# EAGLE board DF32-revision-A (EAGLE 6.6.0), part 1 of 2
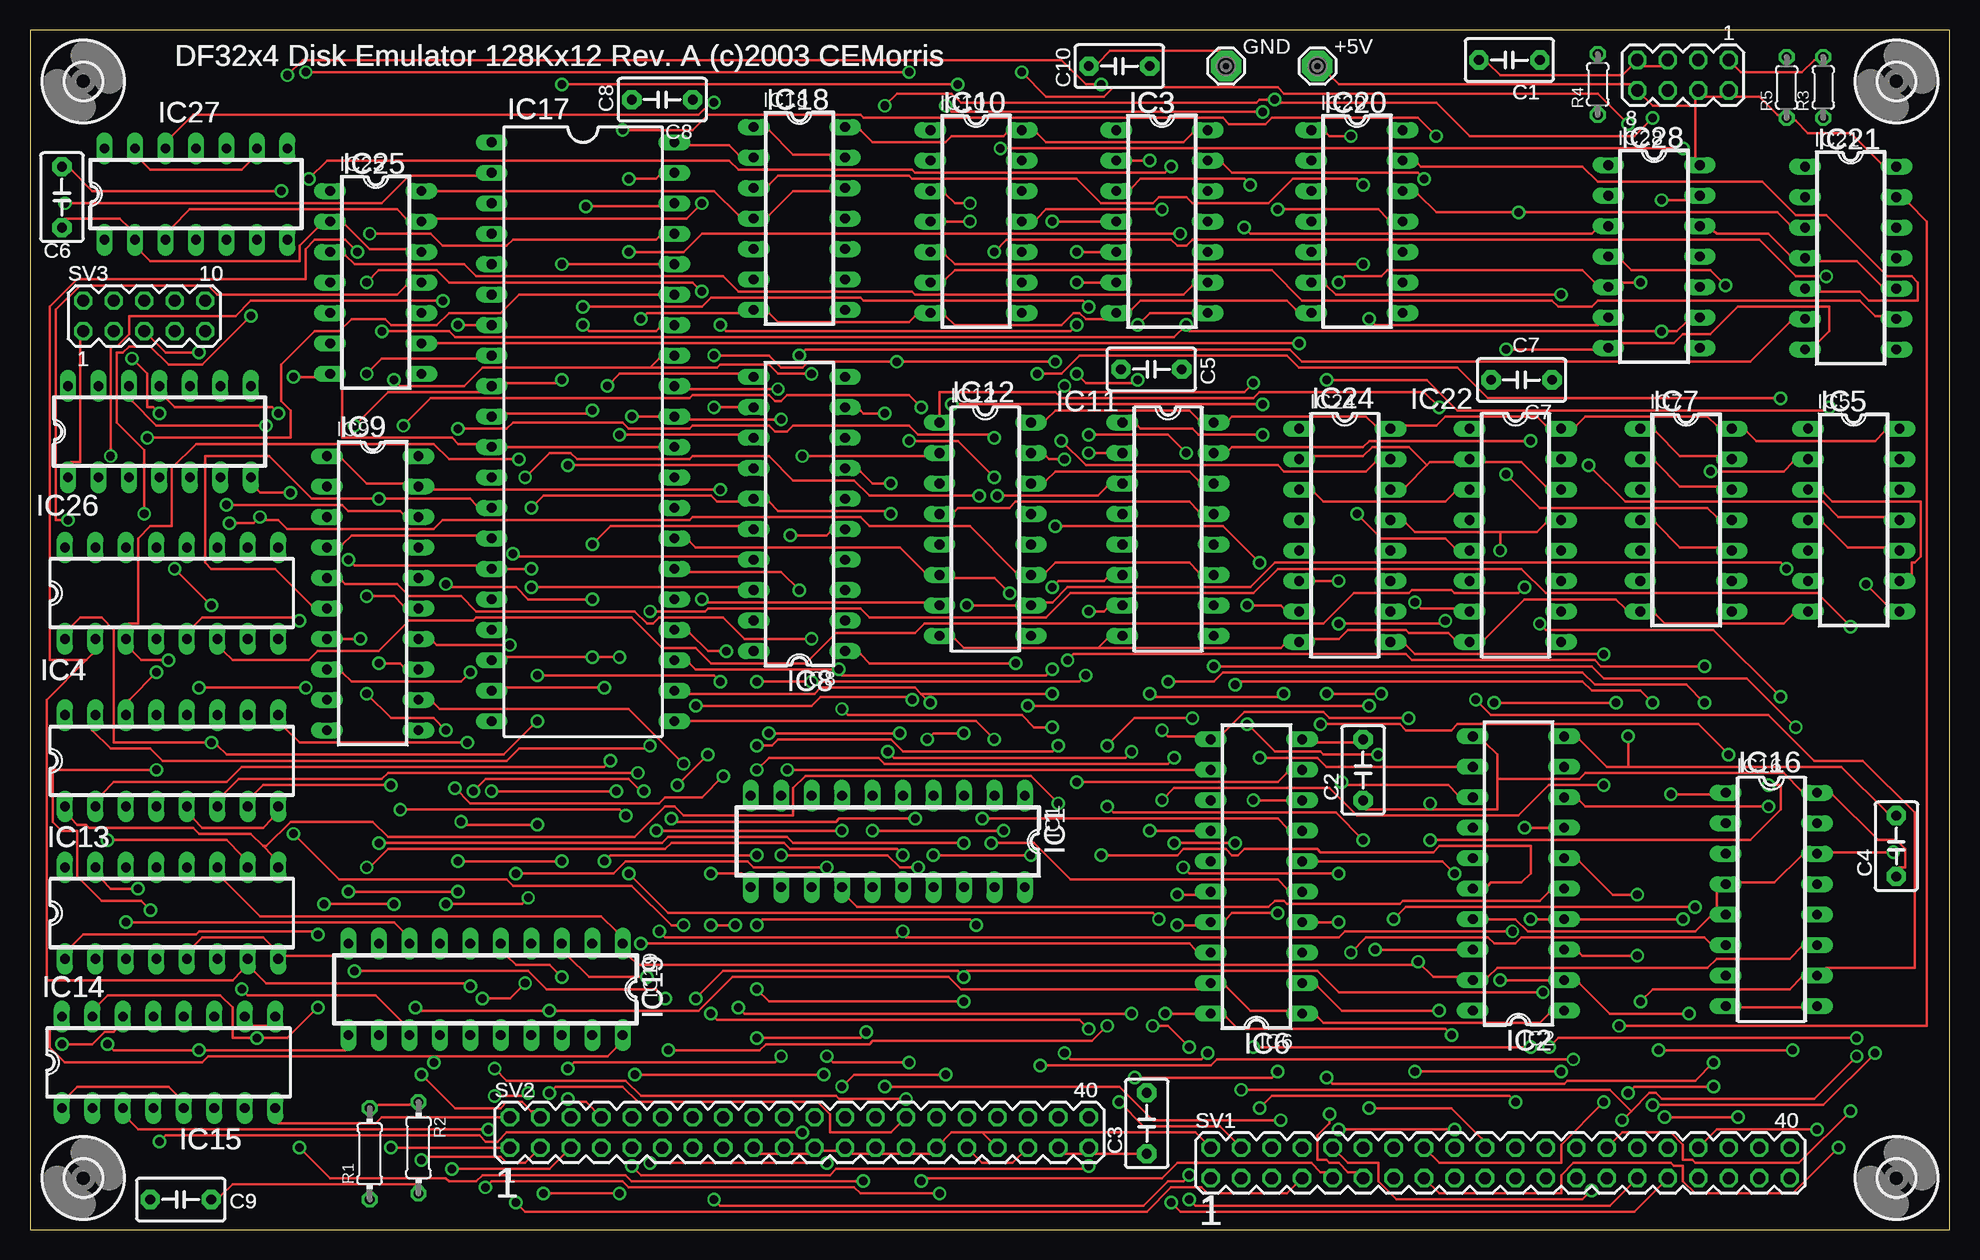
[diagram p2: board, top side]
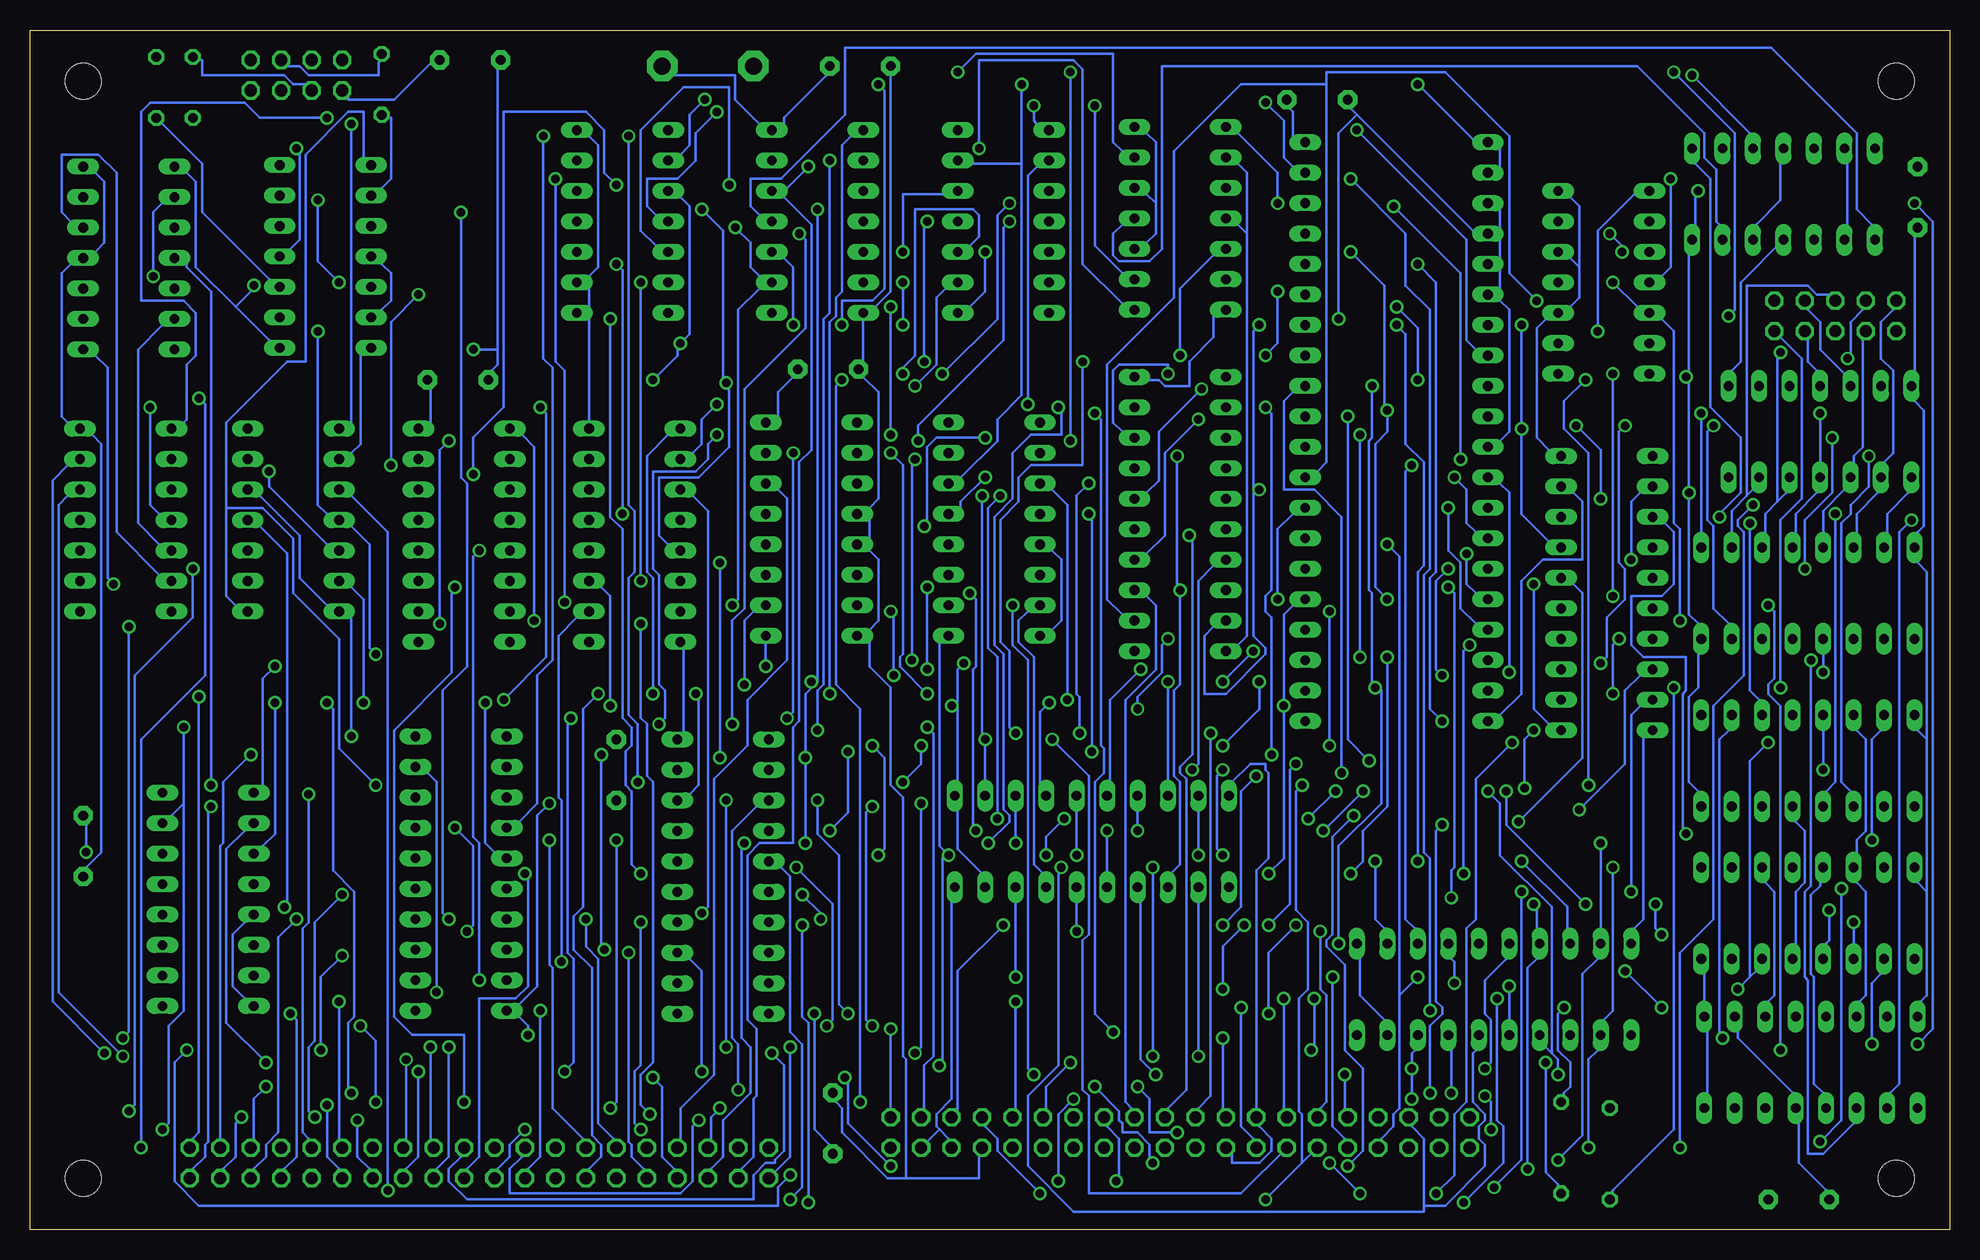
[diagram p3: board, bottom side, seen from below]

Size 160 x 100 mm. Coordinates in mm from the lower left corner, seen from the top.
Outline: 0,0 160,0 160,100 0,100 0,0
Copper layers (1*16): Top 0.035mm / dielectric 1.5mm / Bottom 0.035mm
Design rules "default": minimum track width 8mil, minimum drill 28mil, track to track 8mil, track to pad 8mil, pad to pad 8mil, via to via 8mil, smd to smd 8mil, copper to edge 40mil, drill to drill 8mil, minimum pad ring 10mil, minimum via ring 8mil, stop-mask expansion 4mil, vias tented up to drill 0mil, thermal gap 10mil

## Footprints (pad centres in the part's own frame; a part is rotated, then mirrored left to right if it is on the bottom)
SE14 = drill 1.397 pad 2.54 octagon: MP 0,0
C5B3.5 = drill 0.813 pad 1.6 octagon: 1 -2.54,0; 2 2.54,0
DIL20 = drill 0.813 long: 1 -11.43,-3.81; 2 -8.89,-3.81; 3 -6.35,-3.81; 4 -3.81,-3.81; 5 -1.27,-3.81; 6 1.27,-3.81; 7 3.81,-3.81; 8 6.35,-3.81; 9 8.89,-3.81; 10 11.43,-3.81; 11 11.43,3.81; 12 8.89,3.81; 13 6.35,3.81; 14 3.81,3.81; 15 1.27,3.81; 16 -1.27,3.81; 17 -3.81,3.81; 18 -6.35,3.81; 19 -8.89,3.81; 20 -11.43,3.81
DIL14 = drill 0.813 long: 1 -7.62,-3.81; 2 -5.08,-3.81; 3 -2.54,-3.81; 4 0,-3.81; 5 2.54,-3.81; 6 5.08,-3.81; 7 7.62,-3.81; 8 7.62,3.81; 9 5.08,3.81; 10 2.54,3.81; 11 0,3.81; 12 -2.54,3.81; 13 -5.08,3.81; 14 -7.62,3.81
DIL16 = drill 0.813 long: 1 -8.89,-3.81; 2 -6.35,-3.81; 3 -3.81,-3.81; 4 -1.27,-3.81; 5 1.27,-3.81; 6 3.81,-3.81; 7 6.35,-3.81; 8 8.89,-3.81; 9 8.89,3.81; 10 6.35,3.81; 11 3.81,3.81; 12 1.27,3.81; 13 -1.27,3.81; 14 -3.81,3.81; 15 -6.35,3.81; 16 -8.89,3.81
DIL40 = drill 0.813 long: 1 -24.13,-7.62; 2 -21.59,-7.62; 3 -19.05,-7.62; 4 -16.51,-7.62; 5 -13.97,-7.62; 6 -11.43,-7.62; 7 -8.89,-7.62; 8 -6.35,-7.62; 9 -3.81,-7.62; 10 -1.27,-7.62; 11 1.27,-7.62; 12 3.81,-7.62; 13 6.35,-7.62; 14 8.89,-7.62; 15 11.43,-7.62; 16 13.97,-7.62; 17 16.51,-7.62; 18 19.05,-7.62; 19 21.59,-7.62; 20 24.13,-7.62; 21 24.13,7.62; 22 21.59,7.62; 23 19.05,7.62; 24 16.51,7.62; 25 13.97,7.62; 26 11.43,7.62; 27 8.89,7.62; 28 6.35,7.62; 29 3.81,7.62; 30 1.27,7.62; 31 -1.27,7.62; 32 -3.81,7.62; 33 -6.35,7.62; 34 -8.89,7.62; 35 -11.43,7.62; 36 -13.97,7.62; 37 -16.51,7.62; 38 -19.05,7.62; 39 -21.59,7.62; 40 -24.13,7.62
0204/7 = drill 0.813 octagon: 1 -3.81,0; 2 3.81,0
0204/5 = drill 0.813 octagon: 1 -2.54,0; 2 2.54,0
MA20-2 = drill 1.016 octagon: 1 -24.13,-1.27; 2 -24.13,1.27; 3 -21.59,-1.27; 4 -21.59,1.27; 5 -19.05,-1.27; 6 -19.05,1.27; 7 -16.51,-1.27; 8 -16.51,1.27; 9 -13.97,-1.27; 10 -13.97,1.27; 11 -11.43,-1.27; 12 -11.43,1.27; 13 -8.89,-1.27; 14 -8.89,1.27; 15 -6.35,-1.27; 16 -6.35,1.27; 17 -3.81,-1.27; 18 -3.81,1.27; 19 -1.27,-1.27; 20 -1.27,1.27; 21 1.27,-1.27; 22 1.27,1.27; 23 3.81,-1.27; 24 3.81,1.27; 25 6.35,-1.27; 26 6.35,1.27; 27 8.89,-1.27; 28 8.89,1.27; 29 11.43,-1.27; 30 11.43,1.27; 31 13.97,-1.27; 32 13.97,1.27; 33 16.51,-1.27; 34 16.51,1.27; 35 19.05,-1.27; 36 19.05,1.27; 37 21.59,-1.27; 38 21.59,1.27; 39 24.13,-1.27; 40 24.13,1.27
MA05-2 = drill 1.016 octagon: 1 -5.08,-1.27; 2 -5.08,1.27; 3 -2.54,-1.27; 4 -2.54,1.27; 5 0,-1.27; 6 0,1.27; 7 2.54,-1.27; 8 2.54,1.27; 9 5.08,-1.27; 10 5.08,1.27
MA04-2 = drill 1.016 octagon: 1 -3.81,-1.27; 2 -3.81,1.27; 3 -1.27,-1.27; 4 -1.27,1.27; 5 1.27,-1.27; 6 1.27,1.27; 7 3.81,-1.27; 8 3.81,1.27
3,0 = hole 3: 0,0

## Placement (x,y rotation side)
+5V  SE14  [SE14]  107.31,96.99 0 top
C1  [C5B3.5]  123.31,97.5 180 top
C2  [C5B3.5]  111.12,38.32 90 top
C3  [C5B3.5]  93.09,8.85 90 top
C4  [C5B3.5]  155.57,31.97 90 top
C5  [C5B3.5]  93.47,71.72 180 top
C6  [C5B3.5]  2.66,86.07 90 top
C7  [C5B3.5]  124.33,70.83 180 top
C8  [C5B3.5]  52.7,94.2 180 top
C9  [C5B3.5]  12.57,2.5 180 top
C10  [C5B3.5]  90.8,96.99 180 top
GND  SE14  [SE14]  99.69,96.99 0 top
IC1  74LS240N  [DIL20]  71.5,32.35 180 top
IC2  74LS244N  [DIL20]  124.07,29.68 90 top
IC3  74LS00N  [DIL14]  94.36,84.04 270 top
IC4  74LS138N  [DIL16]  11.81,53.05 0 top
IC5  74LS32N  [DIL14]  152.01,59.14 270 top
IC6  74LS244N  [DIL20]  102.23,29.43 90 top
IC7  74LS74N  [DIL14]  138.04,59.14 270 top
IC8  74LS240N  [DIL20]  64.13,59.65 90 top
IC9  74LS240N  [DIL20]  28.57,53.05 270 top
IC10  74LS04N  [DIL14]  78.86,84.04 270 top
IC11  74LS191N  [DIL16]  94.86,58.38 270 top
IC12  74LS191N  [DIL16]  79.62,58.38 270 top
IC13  74LS191N  [DIL16]  11.81,39.08 0 top
IC14  74LS191N  [DIL16]  11.81,26.38 0 top
IC15  74LS191N  [DIL16]  11.55,13.93 0 top
IC16  74LS191N  [DIL16]  145.16,27.52 270 top
IC17  DS1258  [DIL40]  46.1,66.51 270 top
IC18  74LS74N  [DIL14]  64.13,84.29 270 top
IC19  74LS240N  [DIL20]  37.97,20.03 180 top
IC20  74LS02N  [DIL14]  110.61,84.04 270 top
IC21  74LS01N  [DIL14]  151.76,80.99 270 top
IC22  74LS155N  [DIL16]  123.82,57.87 270 top
IC24  74LS155N  [DIL16]  109.6,57.87 270 top
IC25  74LS74N  [DIL14]  28.82,78.96 270 top
IC26  74LS30N  [DIL14]  10.79,66.51 0 top
IC27  74LS86N  [DIL14]  13.84,86.32 0 top
IC28  74LS07N  [DIL14]  135.38,81.11 270 top
R1  470  [0204/7]  28.32,6.31 90 top
R2  10K  [0204/7]  32.38,6.82 270 top
R3  220  [0204/5]  149.47,95.21 90 top
R4  220  [0204/5]  130.68,95.47 90 top
R5  220  [0204/5]  146.43,95.21 270 top
SV1  BUS1  [MA20-2]  122.55,5.55 0 top
SV2  BUS2  [MA20-2]  64.13,8.09 0 top
SV3  WRLOCK  [MA05-2]  9.52,76.16 0 top
SV4  PANEL LEDS  [MA04-2]  137.79,96.23 180 top
U$1  [3,0]  4.44,95.72 0 top
U$2  [3,0]  4.44,4.28 0 top
U$3  [3,0]  155.57,4.28 0 top
U$4  [3,0]  155.57,95.72 0 top

## Tracks (layer width: path | path; a pad name or v marks a point on that pad's centre or on a via)
660-663  (via drill 0.71)
  Top 0.203: v76.32,93.69 76.83,93.18 v102.74,93.18
  Bottom 0.203: v76.32,93.69 76.32,92.42 76.07,92.16 IC10.1 | v102.74,93.18 104.52,91.4 104.52,89.12 106.04,87.59 108.58,87.59 108.58,85.31 107.82,84.54 IC20.4
!660-663  (via drill 0.71)
  Top 0.203: 116.45,63.72 116.71,63.97 118.74,63.97 IC22.2 121.28,63.97 124.33,63.97 126.36,61.94 IC22.14 | 116.45,63.72 114.68,61.94 IC24.14 | v76.83,68.8 v102.74,68.8 | 116.45,63.72 114.93,65.24 111.88,65.24 111.12,64.48 107.06,64.48 IC24.2
  Bottom 0.203: v76.83,68.8 76.83,87.85 76.07,88.61 IC10.2 | v102.74,68.8 104.01,67.53 104.01,65.49 104.77,64.73 IC24.2
!(NED+EWL)  (via drill 0.71)
  Top 0.203: v110.1,91.15 108.33,91.15 108.07,91.4 IC20.1 | v109.34,37.3 109.6,37.05 118.23,37.05 118.99,36.28 IC2.13
  Bottom 0.203: v110.1,91.15 110.1,60.41 109.6,59.91 109.6,54.83 110.1,54.32 110.1,42.89 109.34,42.13 v109.34,37.3
!ACBUS0  (via drill 0.71)
  Top 0.203: v133.98,22.82 129.41,22.82 129.15,23.08 IC2.3 | v146.93,14.95 v135.76,14.95 | v96.64,4.53 96.13,4.03 94.86,4.03 92.83,1.99 57.53,1.99 v57.02,2.5 | v53.97,37.05 v56.51,39.59 | v57.02,68.54 IC8.12
  Bottom 0.203: v133.98,22.82 135.76,21.04 v135.76,14.95 | v146.93,14.95 147.95,13.93 147.95,4.03 145.92,1.99 97.66,1.99 97.66,3.52 v96.64,4.53 | 53.97,5.55 v57.02,2.5 | SV2.11 53.97,5.55 | v57.02,68.54 56.51,68.03 56.51,53.3 57.02,52.79 57.02,51.52 56.51,51.02 v56.51,39.59 | v53.97,37.05 54.48,36.54 54.48,26.63 53.46,25.62 53.46,20.03 54.22,19.27 54.22,9.87 53.97,9.61 53.97,5.55
!ACBUS1  (via drill 0.71)
  Top 0.203: v51.43,21.04 46.6,21.04 44.83,22.82 IC19.3 | v44.83,63.72 59.05,63.72 IC8.14
  Bottom 0.203: v51.43,21.04 51.43,8.6 50.41,7.58 SV2.9 | v44.83,63.72 45.33,63.21 45.33,25.87 44.57,25.11 IC19.3
!ACBUS2  (via drill 0.71)
  Top 0.203: v44.32,21.04 43.3,22.06 40.51,22.06 39.75,22.82 IC19.5 | v46.86,57.11 48.38,58.64 59.05,58.64 IC8.16
  Bottom 0.203: 45.84,19.52 v44.32,21.04 | 45.84,19.52 45.84,10.12 46.35,9.61 46.35,8.6 47.37,7.58 SV2.7 | v46.86,57.11 45.84,56.1 45.84,19.52
!ACBUS3  (via drill 0.71)
  Top 0.203: v35.17,5.04 43.3,5.04 SV2.5 | v41.78,53.56 59.05,53.56 IC8.18 | v41.52,27.65 41.02,27.14 v34.67,27.14
  Bottom 0.203: v35.17,5.04 35.17,21.81 34.41,22.57 IC19.7 34.41,25.11 34.41,26.89 v34.67,27.14 | v41.78,53.56 41.27,53.05 41.27,30.19 41.52,29.93 v41.52,27.65
!ACBUS4  (via drill 0.71)
  Top 0.203: v32.63,5.8 32.89,6.06 39.24,6.06 39.75,5.55 41.27,5.55 SV2.3 | v77.85,32.22 63.62,32.22 63.11,32.73 53.21,32.73 52.7,32.22 v29.08,32.22
  Bottom 0.203: v32.63,5.8 30.6,7.84 30.6,21.3 29.33,22.57 IC19.9 v29.08,32.22 | v77.85,32.22 IC1.3
!ACBUS5  (via drill 0.71)
  Top 0.203: v30.09,6.82 SV2.1 | v72.77,31.2 72.26,31.71 63.37,31.71 62.86,32.22 53.46,32.22 52.95,31.71 29.84,31.71 28.32,30.19 v28.06,30.19
  Bottom 0.203: v30.09,6.82 30.09,14.19 29.33,14.95 IC19.12 28.82,17.49 28.06,18.25 v28.06,30.19 | v72.77,31.2 IC1.5
!ACBUS6  (via drill 0.71)
  Top 0.203: v32.63,12.92 35.43,10.12 39.24,10.12 39.75,10.63 41.02,10.63 41.78,9.87 42.03,9.87 SV2.4 | v52.19,33.24 v67.69,33.24 | v38.48,36.54 v48.89,36.54
  Bottom 0.203: 33.14,14.69 32.63,14.19 v32.63,12.92 | 33.14,14.69 33.65,15.2 IC19.14 | v48.89,36.54 v52.19,33.24 | v38.48,36.54 37.46,35.52 37.46,31.2 33.14,26.89 33.14,14.69 | v67.69,33.24 IC1.7
!ACBUS7  (via drill 0.71)
  Top 0.203: v62.61,31.2 71.5,31.2 72.51,30.19 v74.04,30.19
  Bottom 0.203: 43.81,1.99 42.03,1.99 38.73,5.3 38.73,7.07 39.24,7.58 39.24,8.6 38.73,9.11 38.73,9.61 39.75,10.63 39.75,14.69 39.49,14.95 IC19.16 | 43.81,1.99 43.81,7.58 44.83,8.6 SV2.6 | v74.04,30.19 74.29,29.93 74.29,13.68 76.83,11.14 76.83,5.3 73.02,1.49 43.81,1.49 43.81,1.99 | v62.61,31.2 IC1.9
!ACBUS8  (via drill 0.71)
  Top 0.203: v44.83,10.88 45.08,10.63 46.35,10.63 SV2.8 | v62.61,14.44 62.1,13.93 45.33,13.93 v44.83,13.42
  Bottom 0.203: v44.83,10.88 v44.83,13.42 44.83,14.69 44.57,14.95 IC19.18 | v62.61,14.44 IC1.12
!ACBUS9  (via drill 0.71)
  Top 0.203: IC1.14 68.19,27.65 68.96,26.89 103.25,26.89 103.75,27.39 104.52,27.39 104.77,27.14 114.17,27.14 114.42,27.39 125.85,27.39 126.61,28.16 IC2.5 | v50.41,12.92 v66.16,12.92
  Bottom 0.203: v50.41,12.92 50.41,10.12 SV2.10 | v66.16,12.92 67.43,14.19 67.43,27.39 IC1.14
!ACBUS10  (via drill 0.71)
  Top 0.203: v52.45,24.85 52.95,24.35 72.26,24.35 v72.77,24.85 73.02,24.35 109.09,24.35 109.6,24.85 v123.57,24.85 | v124.58,33.49 IC2.7
  Bottom 0.203: v52.45,24.85 52.45,20.03 51.94,19.52 51.94,10.63 52.45,10.12 SV2.12 | v72.77,24.85 IC1.16 | v124.58,33.49 123.06,31.97 123.06,25.36 v123.57,24.85
!ACBUS11  (via drill 0.71)
  Top 0.203: v55.49,19.27 57.78,21.55 77.34,21.55 v77.85,21.04 78.1,21.55 107.31,21.55 109.09,19.77 v126.11,19.77
  Bottom 0.203: v55.49,19.27 55.49,10.12 SV2.14 | v77.85,21.04 IC1.18 | v126.11,19.77 126.11,37.3 126.87,38.06 IC2.9
!ACCLEAR  (via drill 0.71)
  Top 0.203: v96.64,15.2 94.86,16.98 v93.59,16.98 | v96.13,30.19 96.64,29.68 v109.09,29.68 | v111.63,75.91 112.14,75.4 130.68,75.4 IC28.6 | v141.35,78.7 140.08,79.97 133.47,79.97 132.71,80.73 IC28.4
  Bottom 0.203: 142.87,76.92 146.17,80.23 146.17,87.34 146.93,88.1 IC21.1 | 142.87,76.92 140.08,74.13 IC28.8 | IC28.6 130.68,76.67 129.92,77.43 129.92,79.72 130.68,80.48 IC28.4 | v96.64,15.2 96.64,6.06 SV1.1 | v93.59,16.98 93.09,17.49 93.09,27.14 v96.13,30.19 | v109.09,29.68 109.85,30.44 109.85,36.54 110.36,37.05 110.36,39.84 109.85,40.35 109.85,41.87 110.61,42.63 110.61,58.38 111.63,59.4 v111.63,75.91 | 142.87,76.92 141.35,78.45 v141.35,78.7
!BADDAC  (via drill 0.71)
  Top 0.203: v130.17,3.26 129.41,2.5 113.91,2.5 112.39,4.03 112.39,5.55 109.85,5.55 SV1.10
  Bottom 0.203: v130.17,3.26 130.17,58.13 133.22,61.18 IC7.3
!BBREAK  (via drill 0.71)
  Top 0.203: v10.54,46.44 8.25,44.16 IC13.14 | IC11.14 97.4,62.45 96.64,63.21 85.47,63.21 84.7,62.45 IC12.14 | v44.32,95.47 v77.34,95.47 | v2.66,15.46 5.2,15.46 6.22,16.47 6.98,16.47 7.23,16.73 IC15.14 | v2.92,85.56 29.33,85.56 31.62,87.85 37.21,87.85 IC17.2
  Bottom 0.203: IC15.14 7.49,19.01 6.98,19.52 6.98,28.16 7.74,28.92 IC14.14 7.74,31.46 7.74,32.47 6.98,33.24 6.98,40.86 7.74,41.62 IC13.14 | v10.54,46.44 IC4.4 | IC17.2 37.46,88.61 37.46,90.13 IC17.1 39.75,90.89 v44.32,95.47 | 77.34,88.86 81.4,88.86 IC10.13 | 77.34,88.86 77.34,69.56 79.37,67.53 79.37,65.75 82.42,62.7 IC12.14 | SV1.8 105.79,7.58 105.79,10.12 102.99,12.92 102.99,37.55 100.2,40.35 100.2,44.16 96.9,47.46 96.9,60.92 97.66,61.68 IC11.14 | v77.34,95.47 77.34,88.86 | v2.66,15.46 1.39,16.73 1.39,84.04 v2.92,85.56
!BRK_RQ  (via drill 0.71)
  Top 0.203: v59.05,18.5 59.56,18 v91.82,18 | v94.36,35.78 95.37,36.79 108.33,36.79 110.61,34.51 124.07,34.51 126.61,37.05 v131.19,37.05
  Bottom 0.203: 143.63,60.16 143.63,67.27 138.55,72.35 137.03,72.35 137.03,89.62 133.47,93.18 132.2,93.18 132.2,89.37 IC28.1 | 143.63,60.16 143.63,52.79 142.87,52.03 IC7.8 | v59.05,18.5 59.05,8.6 58.03,7.58 SV2.15 | v91.82,18 92.58,18.76 92.58,31.2 94.36,32.98 v94.36,35.78 | v131.19,37.05 134.23,40.09 134.23,49.24 138.04,53.05 138.04,57.62 140.58,60.16 143.63,60.16
!BWCO  (via drill 0.71)
  Top 0.203: v111.12,87.08 110.61,87.59 105.28,87.59 103.25,85.56 96.9,85.56 96.39,86.07 94.1,86.07 93.59,85.56 89.28,85.56 87.24,87.59 73.53,87.59 73.27,87.85 62.35,87.85 61.59,87.08 IC18.3 | v123.06,62.95 125.85,60.16 139.82,60.16 140.58,59.4 IC7.11 | v113.66,25.87 114.68,26.89 v138.81,26.89
  Bottom 0.203: v111.12,87.08 112.14,88.1 112.14,91.66 113.66,93.18 120.52,93.18 120.52,68.54 123.06,66 v123.06,62.95 | v113.66,25.87 113.66,23.58 112.64,22.57 112.64,8.85 111.37,7.58 SV1.12 | v138.81,26.89 138.55,27.14 138.55,56.35 140.84,58.64 IC7.11
!DRL  (via drill 0.71)
  Top 0.203: v122.04,43.9 v132.2,43.9
  Bottom 0.203: v132.2,43.9 132.2,52.54 133.22,53.56 IC7.6 | v122.04,43.9 122.04,32.22 121.28,31.46 IC2.15
!EA1  (via drill 0.71)
  Top 0.203: v87.24,71.34 88.01,70.57 92.07,70.57 v92.32,70.83 | v90.8,10.63 92.83,8.6 99.18,8.6 SV1.4
  Bottom 0.203: v87.24,71.34 87.24,71.84 86.23,72.86 86.23,85.05 81.4,85.05 80.89,84.54 80.89,82.77 81.66,82 IC10.10 | v92.32,70.83 92.83,70.32 92.83,45.43 90.8,43.4 v90.8,10.63
!EWL  (via drill 0.71)
  Top 0.203: v80.89,90.13 v137.79,90.13
  Bottom 0.203: v80.89,90.13 80.89,97.5 73.02,97.5 72.26,96.74 72.26,80.48 68.96,77.18 IC18.8 | v137.79,90.13 137.54,89.88 137.54,82.51 138.3,81.75 IC28.11
!INT_RQ  (via drill 0.71)
  Top 0.203: v132.46,16.98 158.11,16.98 158.11,84.04 156.59,85.56 IC21.13 | v131.19,10.63 127.63,7.07 127.63,5.55 117.47,5.55 SV1.16
  Bottom 0.203: v132.46,16.98 131.19,15.71 v131.19,10.63
!IOP4  (via drill 0.71)
  Top 0.203: v85.97,65.75 88.01,63.72 104.01,63.72 104.52,63.21 111.37,63.21 112.14,63.97 IC24.15 | v78.35,84.04 IC10.4
  Bottom 0.203: v78.35,84.04 78.86,83.53 78.86,74.13 85.97,67.02 v85.97,65.75
!IOS  (via drill 0.71)
  Top 0.203: IC28.12 140.33,83.27 140.58,83.02 144.9,83.02 146.68,81.24 IC21.4 149.22,80.73 152.27,80.73 154.3,78.7 IC21.10 | v116.71,32.47 143.38,32.47 145.92,35.01 145.92,37.05 v144.9,37.05
  Bottom 0.203: v116.71,32.47 116.71,22.06 116.45,21.81 116.45,10.12 113.91,7.58 SV1.14 | v144.9,37.05 144.9,78.19 146.93,80.23 146.93,80.48 IC21.4
!IOT601  (via drill 0.71)
  Top 0.203: v116.2,87.59 115.69,88.1 100.2,88.1 99.44,88.86 IC3.13 | v115.44,52.29 115.95,51.78 118.74,51.78 IC22.7
  Bottom 0.203: v116.2,87.59 116.2,72.35 115.44,71.59 v115.44,52.29
!IOT602  (via drill 0.71)
  Top 0.203: IC25.3 26.28,81.24 27.05,80.48 36.19,80.48 37.21,79.46 57.78,79.46 59.05,78.19 73.53,78.19 73.78,77.94 96.13,77.94 96.9,78.7 IC3.9 | v101.21,83.53 101.72,83.02 130.17,83.02 130.42,83.27 IC28.3 | v101.47,52.03 104.26,52.03 104.52,51.78 IC24.7
  Bottom 0.203: v101.21,83.53 99.94,82.26 99.94,80.23 99.18,79.46 IC3.9 99.18,78.45 100.96,76.67 100.96,52.54 v101.47,52.03
!IOT604  (via drill 0.71)
  Top 0.203: IC7.4 135.5,58.89 137.54,56.86 140.58,56.86 IC7.10 | v131.19,47.97 115.44,47.97 114.68,48.73 IC24.9 | v29.33,74.89 34.92,74.89 35.43,74.38 95.37,74.38 v96.39,75.4 96.64,74.89 v136.01,74.89 137.28,74.89 138.04,75.65 IC28.9
  Bottom 0.203: v131.19,47.97 131.69,48.48 131.69,57.11 133.22,58.64 IC7.4 135.25,59.65 136.01,60.41 v136.01,74.89 | v29.33,74.89 29.33,83.27 26.28,86.32 IC25.1 | v96.39,75.4 96.39,80.23 97.15,80.99 IC3.10
!IOT612  (via drill 0.71)
  Top 0.203: v134.23,78.96 132.71,78.96 IC28.5 130.42,78.96 129.41,79.97 113.15,79.97 112.64,79.46 109.6,79.46 v109.09,78.96 | v136.01,85.81 138.04,85.81 IC28.13 | IC24.6 v109.09,54.06
  Bottom 0.203: v134.23,78.96 136.01,80.73 v136.01,85.81 | v109.09,54.06 v109.09,78.96
!IOT614  (via drill 0.71)
  Top 0.203: IC14.11 16.12,29.17 19.17,26.12 47.62,26.12 48.89,24.85 IC19.1 49.91,22.82 50.67,22.06 115.18,22.06 v115.69,22.31 116.96,21.04 118.99,21.04 IC2.19 121.53,21.04 122.3,21.81 139.82,21.81 140.58,22.57 146.68,22.57 147.7,23.58 IC16.11
  Bottom 0.203: IC19.19 47.11,17.49 49.14,19.52 49.14,22.57 IC19.1 | IC15.11 15.11,19.01 14.6,19.52 14.6,28.16 15.36,28.92 IC14.11 | v115.69,22.31 115.69,35.78 115.95,36.03 115.95,49.49 114.42,51.02 IC24.10
!IOT621  (via drill 0.71)
  Top 0.203: v111.12,80.48 77.08,80.48 76.32,81.24 IC10.5 | v110.61,59.65 112.64,57.62 117.98,57.62 118.74,56.86 IC22.5
  Bottom 0.203: v111.12,80.48 110.61,79.97 v110.61,59.65
!IOT622  (via drill 0.71)
  Top 0.203: v86.23,70.32 86.74,69.81 101.21,69.81 v101.98,70.57 | v104.01,85.05 112.39,85.05 113.15,84.29 IC20.11
  Bottom 0.203: v86.23,70.32 84.45,72.1 84.45,77.69 83.69,78.45 IC10.9 | IC24.5 106.8,57.11 107.56,57.87 107.56,62.7 104.26,62.7 101.72,65.24 101.72,70.32 v101.98,70.57 102.23,71.08 102.23,83.27 v104.01,85.05
!IOT624  (via drill 0.71)
  Top 0.203: v82.16,47.21 69.97,47.21 69.21,47.97 IC8.1 | v83.18,43.65 v111.63,43.65
  Bottom 0.203: IC1.19 80.64,29.68 82.67,31.71 82.67,35.01 IC1.1 82.67,37.3 82.67,43.65 | v82.16,47.21 82.67,46.7 82.67,43.65 | v111.63,43.65 111.63,52.79 112.39,53.56 IC24.11 | 82.67,43.65 v83.18,43.65
!LAD  (via drill 0.71)
  Top 0.203: IC11.11 97.4,54.83 96.64,55.59 85.47,55.59 84.7,54.83 IC12.11 82.16,54.83 78.35,58.64 69.97,58.64 69.21,59.4 55.24,59.4 54.99,59.14 34.41,59.14 33.65,58.38 21.46,58.38 20.7,59.14 19.68,59.14 v19.17,59.4 18.66,58.89 v16.63,58.89
  Bottom 0.203: v19.17,59.4 19.17,59.65 17.39,61.43 17.39,66 19.93,68.54 19.93,87.59 21.2,88.86 IC27.8 | v16.63,58.89 16.63,44.92 15.87,44.16 IC13.11
!OE  (via drill 0.71)
  Top 0.203: IC9.1 26.03,64.22 28.06,62.19 31.11,62.19 IC9.19 33.65,61.68 v57.53,61.68 | v87.24,75.4 86.74,74.89 58.03,74.89 v57.53,75.4 | v87.24,78.96 IC3.6
  Bottom 0.203: IC17.20 37.46,42.89 35.68,44.67 35.68,54.06 33.9,55.84 30.6,55.84 30.6,60.67 31.36,61.43 IC9.19 | v87.24,75.4 v87.24,78.96 | v57.53,75.4 58.03,74.89 58.03,61.68 | 58.03,61.68 58.03,49.49 57.02,48.48 57.02,47.97 60.32,44.67 62.1,44.67 62.1,49.49 61.34,50.25 IC8.19 | v57.53,61.68 58.03,61.68
!PWRCLR  (via drill 0.71)
  Top 0.203: v23.24,87.59 24.76,89.12 58.29,89.12 59.05,88.35 73.53,88.35 73.78,88.1 94.61,88.1 v95.12,88.61
  Bottom 0.203: v23.24,87.59 23.24,80.23 24,79.46 IC25.4 | v95.12,88.61 96.9,86.83 IC3.12 97.15,86.07 94.86,83.78 94.86,64.99 95.88,63.97 95.88,42.38 96.39,41.87 96.39,32.22 99.18,32.22 100.2,31.2 100.2,17.49 99.44,16.73 99.44,11.14 99.69,10.88 99.69,6.06 100.71,5.04 SV1.3
!SCL  (via drill 0.71)
  Top 0.203: IC7.1 135.5,66.51 137.54,64.48 140.58,64.48 IC7.13 | IC18.1 61.59,91.66 63.62,89.62 66.67,89.62 IC18.13 | IC27.3 11.81,83.53 13.33,85.05 30.6,85.05 31.36,84.29 IC25.13 33.9,84.29 54.73,84.29 v56,85.56 | v133.22,92.16 130.68,94.7 104.52,94.7 104.01,95.21 90.29,95.21 89.53,94.45 84.7,94.45 v82.67,96.48
  Bottom 0.203: v56,85.56 56,88.1 59.3,91.4 IC18.1 | v133.22,92.16 133.22,67.27 IC7.1 | v82.67,96.48 81.15,98.01 69.72,98.01 69.72,90.64 68.96,89.88 IC18.13
!WE  (via drill 0.71)
  Top 0.203: v57.02,93.94 56.76,93.94 55.75,92.93 13.58,92.93 11.81,91.15 IC27.12 | R1.2 29.08,10.38 31.62,10.38 R2.1 | IC2.1 126.61,18 125.85,17.23 107.82,17.23 107.31,17.74 IC6.1 104.77,18.25 101.72,18.25 99.69,20.28 IC6.19 97.4,20.03 77.59,20.03 76.58,21.04 58.54,21.04 55.75,18.25 v43.3,18.25 32.38,18.25 v32.13,18.5 | v49.91,87.59 52.19,87.59 52.45,87.85 IC17.39
  Bottom 0.203: v57.02,93.94 55.49,92.42 55.49,89.37 54.73,88.61 IC17.39 | v32.13,18.5 32.63,18 32.63,14.95 31.62,13.93 31.62,11.9 32.13,11.39 R2.1 | v49.91,87.59 45.33,83.02 45.33,78.7 43.3,76.67 43.3,55.08 43.81,54.57 43.81,31.46 43.3,30.95 v43.3,18.25
!WR1
  Top 0.203: SV3.1 4.19,74.13 4.19,63.97 3.42,63.97 IC26.1
  Bottom 0.203: IC26.1 3.42,61.43 5.2,59.65 5.2,58.13 IC4.15
!WR2
  Bottom 0.203: IC4.14 7.74,58.13 7.74,59.65 5.96,61.43 IC26.2 5.46,63.97 4.69,64.73 4.69,71.59 5.71,72.61 5.71,75.65 4.69,76.67 SV3.2
!WR3
  Bottom 0.203: IC4.13 10.54,59.91 8.76,61.68 IC26.3 8,63.97 8,64.48 7.23,65.24 7.23,74.13 SV3.3
!WR4  (via drill 0.71)
  Top 0.203: v8.5,72.61 9.77,71.34 9.77,68.54 10.28,68.54 v10.79,68.03
  Bottom 0.203: IC4.12 12.82,58.13 12.82,59.65 11.04,61.43 IC26.4 v10.79,68.03 | v8.5,72.61 8.25,72.86 8.25,75.65 7.23,76.67 SV3.4
!WR5  (via drill 0.71)
  Top 0.203: v14.09,73.11 11.3,73.11 SV3.5
  Bottom 0.203: 14.35,60.67 15.36,59.65 15.36,58.13 IC4.11 | 14.35,60.67 13.58,61.43 IC26.5 | v14.09,73.11 14.35,72.86 14.35,60.67
!WR6
  Bottom 0.203: 16.89,61.18 18.16,59.91 IC4.10 | 16.89,61.18 16.38,61.68 IC26.6 | 16.89,61.18 16.89,78.7 11.81,78.7 11.04,77.94 10.03,77.94 SV3.6
!WR7  (via drill 0.71)
  Top 0.203: v20.7,68.03 20.19,68.54 12.06,68.54 11.3,69.3 IC26.11
  Bottom 0.203: IC26.11 11.04,71.59 11.81,72.35 11.81,74.13 SV3.7 | IC4.9 v20.7,68.03
!WR8  (via drill 0.71)
  Top 0.203: v19.68,67.02 10.54,67.02 8.5,69.05 IC26.12
  Bottom 0.203: IC26.12 8.76,71.34 10.79,73.37 10.79,75.65 11.81,76.67 SV3.8 | v19.68,67.02 20.19,66.51 20.19,59.14 19.68,58.64 19.68,51.78 18.41,50.51 IC4.7
BAC0  (via drill 0.71)
  Top 0.203: v36.44,40.6 22.47,40.6 21.2,41.87 IC13.9 | v42.79,3.01 v49.14,3.01 | v51.68,5.55 v66.42,5.55 | v71.24,11.9 90.8,11.9 93.59,9.11 v104.26,9.11
  Bottom 0.203: v36.44,40.6 39.49,37.55 39.49,25.87 40.25,25.11 40.25,10.63 41.27,9.61 41.27,4.53 v42.79,3.01 | v49.14,3.01 v51.68,5.55 | v66.42,5.55 66.67,5.8 66.67,7.07 67.69,8.09 68.96,8.09 68.96,8.85 69.21,9.11 69.21,9.87 v71.24,11.9 | v104.26,9.11 104.77,8.6 104.77,4.03 105.79,3.01 120.01,3.01 120.01,5.04 118.99,6.06 SV1.18
BAC1  (via drill 0.71)
  Top 0.203: IC15.15 5.71,18.76 6.47,19.52 15.87,19.52 16.89,18.5 16.89,15.96 v18.92,15.96 21.46,15.96 v24,18.5 | v111.63,10.12 118.49,10.12 121.03,7.58 SV1.20 | v111.12,32.47 108.83,34.76 90.29,34.76 v89.78,35.27 | v89.78,16.98 88.51,15.71 70.23,15.71 69.97,15.46 61.34,15.46 60.83,14.95 v53.21,14.95 | v52.95,19.27 52.19,20.03 43.05,20.03 41.52,21.55 v27.05,21.55
  Bottom 0.203: v18.92,15.96 19.17,16.22 19.17,40.86 18.41,41.62 IC13.10 | v111.63,10.12 111.12,10.63 v111.12,32.47 | v89.78,35.27 90.29,34.76 90.29,17.49 v89.78,16.98 | v53.21,14.95 52.95,15.2 v52.95,19.27 | v24,18.5 v27.05,21.55
BAC2  (via drill 0.71)
  Top 0.203: 19.43,31.97 20.19,31.2 IC14.9 | 19.43,31.97 18.41,32.98 14.09,32.98 13.58,33.49 4.95,33.49 4.69,33.74 3.93,33.74 3.42,34.25 IC13.1 | v98.17,14.69 97.66,14.19 86.74,14.19 v86.23,14.69 | v85.72,35.52 83.43,37.81 64.64,37.81 63.62,36.79 63.62,34.51 54.48,34.51 53.72,35.27 52.95,35.27 50.41,32.73 29.84,32.73 28.57,34 21.71,34 19.68,31.97 19.43,31.97
  Bottom 0.203: v98.17,14.69 97.15,13.68 97.15,6.57 97.91,5.8 97.91,5.55 98.67,5.55 99.69,4.53 99.69,2.5 123.57,2.5 125.09,4.03 125.09,5.04 124.07,6.06 SV1.22 | v86.23,14.69 85.72,15.2 v85.72,35.52
BAC3  (via drill 0.71)
  Top 0.203: v6.47,32.47 16.38,32.47 17.65,31.2 IC14.10 | v126.61,15.2 127.38,15.96 v152.27,15.96 | v151.76,50.25 148.97,53.05 126.36,53.05 124.33,55.08 104.01,55.08 101.98,53.05 86.74,53.05 84.7,51.02 69.97,51.02 69.21,51.78 56.51,51.78 56.26,51.52 v51.68,51.52 | v51.68,40.35 51.43,40.09 40.76,40.09 39.75,39.08 11.04,39.08 10.03,40.09 6.73,40.09 5.2,41.62 IC13.15
  Bottom 0.203: v6.47,32.47 6.47,40.86 5.71,41.62 IC13.15 | v126.61,15.2 126.61,7.58 SV1.24 | v152.27,15.96 151.76,16.47 v151.76,50.25 | v51.68,40.35 v51.68,51.52
BAC4  (via drill 0.71)
  Top 0.203: v24,24.6 23.74,24.85 14.09,24.85 13.84,24.6 4.44,24.6 3.42,23.58 IC14.1 | v24.51,27.14 v30.35,27.14 | v36.95,36.54 37.97,37.55 49.91,37.55 50.92,36.54 v51.18,36.54 | v53.46,34.25 53.72,34 67.18,34 67.43,34.25 v73.78,34.25 | v75.31,31.2 v83.43,31.2 | v128.65,14.19 98.93,14.19 98.42,13.68 v84.2,13.68
  Bottom 0.203: v24,24.6 24.51,25.11 v24.51,27.14 | v30.35,27.14 36.95,33.74 v36.95,36.54 | v51.18,36.54 v53.46,34.25 | v73.78,34.25 75.31,32.73 v75.31,31.2 | IC12.9 84.2,48.98 84.2,31.97 v83.43,31.2 83.94,30.95 83.94,13.93 v84.2,13.68 | v128.65,14.19 128.65,7.58 SV1.26
BAC5  (via drill 0.71)
  Top 0.203: v9.01,28.41 6.73,28.41 5.96,29.17 IC14.15 | v10.79,7.33 11.3,7.84 37.46,7.84 37.97,7.33 38.98,7.33 39.75,8.09 v64.38,8.09 | v67.69,11.9 68.7,12.92 v76.32,12.92 | v78.1,52.03 IC12.10 84.7,52.29 85.21,52.29 86.48,53.56 101.72,53.56 103.75,55.59 145.92,55.59 v146.43,55.08 | v151.76,9.87 147.44,5.55 138.81,5.55 138.55,5.8 137.79,5.8 137.79,7.07 136.77,8.09 132.71,8.09 SV1.28
  Bottom 0.203: v9.01,28.41 9.01,9.11 v10.79,7.33 | v64.38,8.09 66.67,8.09 66.67,10.88 v67.69,11.9 | v76.32,12.92 76.83,13.42 76.83,47.46 78.1,48.73 v78.1,52.03 | v151.76,9.87 151.25,10.38 151.25,46.19 146.43,51.02 v146.43,55.08
BAC6  (via drill 0.71)
  Top 0.203: v117.47,68.54 116.2,69.81 102.48,69.81 101.98,69.3 85.97,69.3 85.47,69.81 75.81,69.81 IC12.1 | v120.52,44.16 121.79,42.89 144.9,42.89 148.71,39.08 152.78,39.08 157.09,34.76 157.09,21.81 149.73,21.81 IC16.10 147.7,21.04 146.68,20.03 135.25,20.03 v134.23,19.01
  Bottom 0.203: v117.47,68.54 116.96,68.03 116.96,47.71 v120.52,44.16 | v134.23,19.01 134.23,7.58 SV1.30
BAC7  (via drill 0.71)
  Top 0.203: v86.23,64.22 84.96,64.22 84.7,64.48 IC12.15 | v86.48,47.46 86.99,47.97 114.68,47.97 115.18,47.46 130.42,47.46 130.93,46.95 v139.57,46.95 | v136.77,36.28 140.08,36.28 IC16.1
  Bottom 0.203: v86.23,64.22 86.48,63.97 v86.48,47.46 | v139.57,46.95 140.58,45.94 140.58,37.05 IC16.1 | v136.77,36.28 136.77,25.62 137.28,25.11 137.28,8.09 136.77,7.58 SV1.32
BAC8  (via drill 0.71)
  Top 0.203: v98.67,46.95 130.17,46.95 131.19,45.94 143.12,45.94 v147.19,41.87 | v148.97,8.34 140.58,8.34 SV1.34
  Bottom 0.203: 147.19,35.52 v147.19,41.87 | 147.19,35.52 148.2,34.51 IC16.15 | v98.67,46.95 IC11.9 | v148.97,8.34 148.46,8.85 148.46,16.98 147.19,18.25 147.19,35.52
BAC9  (via drill 0.71)
  Top 0.203: v100.45,45.43 100.71,45.68 129.41,45.68 130.17,44.92 134.23,44.92 v135.25,43.9 | v133.22,11.39 133.73,11.9 v140.33,11.9
  Bottom 0.203: v100.45,45.43 100.45,50.76 99.69,51.52 IC11.10 | v135.25,43.9 134.74,43.4 134.74,29.93 132.96,28.16 132.96,17.74 133.47,17.23 133.47,11.65 v133.22,11.39 | v140.33,11.9 141.35,10.88 141.35,7.58 SV1.36
BAC10  (via drill 0.71)
  Top 0.203: v102.74,66.26 97.4,66.26 96.9,66.76 92.58,66.76 92.32,67.02 IC11.1 | v107.56,42.13 114.17,42.13 114.68,41.62 118.49,41.62 118.99,42.13 139.06,42.13 v141.6,39.59
  Bottom 0.203: v102.74,66.26 103.5,65.49 103.5,64.22 104.52,63.21 108.07,63.21 108.07,55.08 107.56,54.57 107.56,45.43 107.06,44.92 107.06,42.63 v107.56,42.13 | v141.6,39.59 143.89,37.3 143.89,32.22 144.14,31.97 SV1.38
BAC11  (via drill 0.71)
  Top 0.203: v125.09,65.75 111.63,65.75 111.12,65.24 100.2,65.24 99.94,64.99 IC11.15 | v125.85,50.51 126.36,50 140.33,50 v145.92,44.41
  Bottom 0.203: v125.09,65.75 125.85,64.99 v125.85,50.51 | v145.92,44.41 145.92,8.09 146.43,7.58 SV1.40
BIOP1  (via drill 0.71)
  Top 0.203: v117.98,50.76 117.72,50.51 v109.09,50.51 | v108.33,9.61 108.33,8.85 107.31,7.84 107.31,5.8 108.07,5.8 108.33,5.55 109.09,5.55 109.85,4.79 110.61,4.79 SV1.11
  Bottom 0.203: v117.98,50.76 117.98,65.24 118.99,66.26 IC22.1 | v109.09,50.51 109.09,42.63 108.58,42.13 108.58,37.81 108.07,37.3 108.07,13.93 109.09,12.92 109.09,10.38 v108.33,9.61
BIOP2  (via drill 0.71)
  Top 0.203: v112.64,44.67 v108.07,44.67
  Bottom 0.203: v108.07,44.67 108.07,54.32 108.58,54.83 108.58,64.48 106.8,66.26 IC24.1 | v112.64,44.67 113.91,43.4 113.91,26.89 114.68,26.12 114.68,23.33 113.15,21.81 113.15,7.84 112.39,7.07 112.39,6.06 113.41,5.04 SV1.13
BIOP4  (via drill 0.71)
  Top 0.203: v78.35,85.56 77.08,85.56 76.32,86.32 IC10.3 | v83.94,71.34 85.97,71.34 87.5,72.86 104.77,72.86 105.79,71.84 118.99,71.84 121.53,69.3 v145.92,69.3 | v150.74,6.82 146.93,3.01 138.81,3.01 137.79,4.03 137.79,5.3 137.03,5.3 136.77,5.55 128.65,5.55 127.63,4.53 127.63,3.01 117.47,3.01 SV1.15
  Bottom 0.203: v78.35,85.56 79.37,84.54 79.37,75.91 v83.94,71.34 | v145.92,69.3 145.41,68.8 145.41,46.19 150.74,40.86 v150.74,6.82
BMB0  (via drill 0.71)
  Top 0.203: v117.47,18.25 109.34,18.25 107.31,20.28 IC6.2
  Bottom 0.203: v117.47,18.25 117.47,6.06 118.49,5.04 SV1.17
BMB1  (via drill 0.71)
  Top 0.203: v109.09,8.34 v118.74,8.34 | v109.09,25.62 IC6.4
  Bottom 0.203: v109.09,25.62 109.09,13.68 109.6,13.17 109.6,8.85 v109.09,8.34 | v118.74,8.34 120.01,7.07 120.01,6.06 121.03,5.04 SV1.19
BMB2  (via drill 0.71)
  Top 0.203: v118.74,29.68 117.72,30.7 IC6.6
  Bottom 0.203: v118.74,29.68 118.49,29.43 118.49,20.28 119.5,19.27 122.55,19.27 122.55,6.06 123.57,5.04 SV1.21
BMB3  (via drill 0.71)
  Top 0.203: v93.34,44.67 93.59,44.41 104.26,44.41 v104.52,44.67 | v101.98,15.2 v125.09,15.2 | v101.98,35.78 IC6.8
  Bottom 0.203: v93.34,44.67 93.34,75.65 92.83,76.16 92.83,77.69 92.32,78.19 92.32,90.39 91.56,91.15 IC3.1 | v104.52,44.67 104.26,44.41 104.26,37.05 105.02,36.28 IC6.8 | v125.09,15.2 125.09,6.06 126.11,5.04 SV1.23 | v101.98,15.2 v101.98,35.78
BMB4  (via drill 0.71)
  Top 0.203: v94.36,41.62 94.86,41.11 97.15,41.11 IC6.11 99.44,41.36 101.21,43.14 107.82,43.14 108.33,42.63 v114.93,42.63 | v93.34,89.12 IC3.2 | v115.44,13.17 v127.63,13.17
  Bottom 0.203: v93.34,89.12 93.34,76.42 93.85,75.91 93.85,45.43 94.36,44.92 v94.36,41.62 | v127.63,13.17 127.63,6.06 128.65,5.04 SV1.25 | v115.44,13.17 114.68,13.93 114.68,22.57 115.18,23.08 115.18,42.38 v114.93,42.63
BMB5  (via drill 0.71)
  Top 0.203: v152.27,14.44 148.71,10.88 136.01,10.88 135.5,11.39 135,11.39 133.47,9.87 | 133.47,9.87 v132.71,9.11 | v100.96,11.65 131.69,11.65 133.47,9.87
  Bottom 0.203: v152.27,14.44 157.6,19.77 157.6,60.41 156.84,61.18 IC5.12 | v132.71,9.11 132.71,6.06 131.69,5.04 SV1.27 | v100.96,11.65 100.96,15.46 101.47,15.96 101.47,33.24 99.44,35.27 IC6.13
BMB6  (via drill 0.71)
  Top 0.203: v153.79,14.69 149.47,10.38 v135.25,10.38 | v96.64,2.5 97.15,1.99 131.69,1.99 SV1.29
  Bottom 0.203: v153.79,14.69 158.11,19.01 158.11,62.45 156.84,63.72 IC5.13 | v135.25,10.38 135.25,6.06 134.23,5.04 SV1.29 | v96.64,2.5 95.63,3.52 95.63,15.46 96.64,16.47 96.64,29.43 97.4,30.19 IC6.15
BMB7  (via drill 0.71)
  Top 0.203: v104.01,26.38 100.2,26.38 99.69,25.87 IC6.17 97.15,25.36 v95.63,25.36 | IC22.3 118.74,61.43 117.98,60.67 107.82,60.67 107.06,61.43 IC24.3 | v95.12,2.25 95.88,1.49 133.73,1.49 SV1.31
  Bottom 0.203: v104.01,26.38 103.5,26.89 103.5,59.91 104.77,61.18 IC24.3 | v95.12,2.25 95.12,17.23 95.63,17.74 v95.63,25.36
BMB8  (via drill 0.71)
  Top 0.203: 122.55,58.13 125.6,58.13 126.36,58.89 IC22.13 | 122.55,58.13 115.44,58.13 114.68,58.89 IC24.13 | v138.3,18 131.69,18 129.15,20.54 IC2.2 v122.55,20.79 | v122.55,56.6 122.55,58.13
  Bottom 0.203: v138.3,18 137.79,17.49 137.79,6.06 138.81,5.04 SV1.33 | v122.55,56.6 123.06,56.1 123.06,32.73 122.55,32.22 v122.55,20.79
BMB9  (via drill 0.71)
  Top 0.203: v137.79,25.87 IC2.4 v125.09,25.87 | IC20.12 115.69,86.32 117.22,84.8 v124.07,84.8 145.66,84.8 146.68,83.78 IC21.3
  Bottom 0.203: v137.79,25.87 139.31,24.35 139.31,8.09 140.33,7.07 140.33,6.06 141.35,5.04 SV1.35 | v125.09,25.87 125.6,26.38 125.6,44.92 123.57,46.95 123.57,62.19 124.07,62.7 v124.07,84.8
BMB10  (via drill 0.71)
  Top 0.203: v133.98,27.9 131.95,27.9 129.15,30.7 IC2.6 | v136.27,9.36 v142.36,9.36
  Bottom 0.203: v133.98,27.9 136.27,25.62 136.27,15.71 136.77,15.2 136.77,9.87 v136.27,9.36 | v142.36,9.36 142.87,8.85 142.87,6.06 143.89,5.04 SV1.37
BMB11  (via drill 0.71)
  Top 0.203: v144.9,35.27 129.66,35.27 129.15,35.78 IC2.8
  Bottom 0.203: v144.9,35.27 145.16,35.01 145.16,7.33 145.41,7.07 145.41,6.06 146.43,5.04 SV1.39
BTS3  (via drill 0.71)
  Top 0.203: v124.58,53.56 124.07,53.05 118.74,53.05 118.49,53.3 115.18,53.3 114.93,53.05 110.36,53.05 107.82,50.51 74.54,50.51 73.78,49.75 67.18,49.75 64.64,47.21 56.76,47.21 55.49,48.48 52.7,48.48 50.16,51.02 37.21,51.02 36.95,50.76 31.62,50.76 29.08,48.22 24,48.22 23.24,47.46 16.89,47.46 16.12,48.22 IC4.6 | v123.82,10.63 123.31,11.14 103.5,11.14 v102.48,10.12
  Bottom 0.203: v124.58,53.56 124.84,53.3 124.84,46.44 129.66,41.62 129.66,17.74 128.14,16.22 123.82,16.22 v123.82,10.63 | v102.48,10.12 103.25,9.36 103.25,7.58 SV1.6
DATA0  (via drill 0.71)
  Top 0.203: v71.24,68.03 69.46,68.03 69.21,68.29 IC8.9 | v69.72,16.47 69.21,15.96 v60.57,15.96
  Bottom 0.203: v71.24,68.03 70.73,67.53 70.73,40.35 70.48,40.09 70.48,38.06 71.24,37.3 71.24,18 v69.72,16.47 | v60.57,15.96 60.57,10.12 SV2.18
DATA1  (via drill 0.71)
  Top 0.203: v71.75,62.19 70.23,62.19 69.21,63.21 IC8.7 | v61.59,41.36 v72.51,41.36
  Bottom 0.203: v71.75,62.19 72.77,61.18 72.77,44.67 72.51,44.41 v72.51,41.36 | v61.59,41.36 61.59,11.14 62.61,10.12 SV2.20
DATA2  (via drill 0.71)
  Top 0.203: v63.37,57.87 66.42,57.87 66.67,58.13 IC8.5
  Bottom 0.203: v63.37,57.87 63.11,57.62 63.11,39.59 64.13,38.57 64.13,38.06 63.62,37.55 63.62,11.65 65.15,10.12 SV2.22
DATA3
  Bottom 0.203: IC8.3 66.92,52.79 66.16,52.03 66.16,46.7 68.7,44.16 68.7,10.63 68.19,10.12 SV2.24
DATA4  (via drill 0.71)
  Top 0.203: v16.38,60.41 26.03,60.41 26.54,59.91 30.86,59.91 31.11,59.65 IC9.18 | v22.47,6.82 25.01,4.28 34.67,4.28 34.92,4.03 37.21,4.03 37.71,4.53 49.65,4.53 50.16,4.03 v69.46,4.03
  Bottom 0.203: v16.38,60.41 17.65,59.14 17.65,58.64 17.14,58.13 17.14,46.19 19.68,43.65 19.68,25.87 22.47,23.08 v22.47,6.82 | v69.46,4.03 69.21,4.28 69.21,7.58 70.23,8.6 SV2.26
DATA5  (via drill 0.71)
  Top 0.203: v35.94,34 36.19,33.74 v42.29,33.74 | v43.3,11.39 43.81,11.9 49.4,11.9 50.67,10.63 65.65,10.63 66.67,9.61 66.67,8.09 71.75,8.09 SV2.28
  Bottom 0.203: v35.94,34 30.6,39.33 30.6,53.05 31.36,53.81 IC9.16 | v42.29,33.74 42.79,33.24 42.79,19.01 42.29,18.5 42.29,18 43.3,16.98 v43.3,11.39
DATA6  (via drill 0.71)
  Top 0.203: v40,48.73 33.9,48.73 33.65,48.98 IC9.14 | v40.51,29.68 48.64,29.68 49.65,30.7 59.81,30.7 60.32,30.19 v66.42,30.19 | v66.42,14.44 66.92,13.93 v73.27,13.93
  Bottom 0.203: v40,48.73 40.51,48.22 v40.51,29.68 | v66.42,30.19 v66.42,14.44 | v73.27,13.93 75.31,11.9 75.31,10.12 SV2.30
DATA7  (via drill 0.71)
  Top 0.203: v54.48,38.82 49.91,43.4 34.16,43.4 33.65,43.9 IC9.12 | v56.76,25.36 v58.8,25.36 | v60.57,20.03 61.59,19.01 v77.85,19.01
  Bottom 0.203: v54.48,38.82 54.99,38.32 54.99,27.14 v56.76,25.36 | v58.8,25.36 60.57,23.58 v60.57,20.03 | v77.85,19.01 77.85,10.12 SV2.32
DATA8  (via drill 0.71)
  Top 0.203: v35.68,28.16 v26.54,28.16 | v37.97,3.52 38.48,4.03 49.4,4.03 49.91,3.52 68.7,3.52 69.21,3.01 v75.81,3.01
  Bottom 0.203: v26.54,28.16 26.54,42.89 25.78,43.65 IC9.9 | v35.68,28.16 35.68,5.8 v37.97,3.52 | v75.81,3.01 79.37,6.57 79.37,7.58 80.39,8.6 SV2.34
DATA9  (via drill 0.71)
  Top 0.203: v28.06,44.67 30.09,42.63 33.65,42.63 v34.67,41.62 | v35.43,36.79 36.7,35.52 52.45,35.52 52.95,36.03 56,36.03 v57.78,37.81 | v60.57,25.36 61.08,25.87 78.35,25.87 v78.86,25.36 | v27.55,49.24 IC9.7
  Bottom 0.203: v27.55,49.24 28.06,48.73 v28.06,44.67 | v34.67,41.62 35.43,40.86 v35.43,36.79 | v57.78,37.81 59.05,36.54 59.05,26.89 v60.57,25.36 | v78.86,25.36 82.67,21.55 82.67,9.87 SV2.36
DATA10  (via drill 0.71)
  Top 0.203: v65.15,49.24 59.56,49.24 57.78,51.02 52.45,51.02 51.94,50.51 51.43,50.51 50.41,51.52 37.21,51.52 35.94,52.79 31.62,52.79 30.6,53.81 26.28,53.81 26.03,54.06 IC9.5 | v67.69,43.4 68.19,42.89 82.67,42.89 83.69,41.87 v85.21,41.87
  Bottom 0.203: v65.15,49.24 65.65,48.73 65.65,46.44 67.69,44.41 v67.69,43.4 | v85.21,41.87 84.7,41.36 84.7,14.44 85.47,13.68 85.47,10.12 SV2.38
DATA11  (via drill 0.71)
  Top 0.203: v21.97,32.98 25.78,29.17 39.75,29.17 40.25,28.66 50.16,28.66 53.46,25.36 v54.48,25.36 | v56.76,18 57.27,17.49 87.5,17.49 v88.26,16.73
  Bottom 0.203: v21.97,32.98 22.22,33.24 22.22,44.67 21.97,44.92 21.97,47.71 25.52,47.71 26.54,48.73 26.54,52.79 24,52.79 22.98,53.81 22.98,58.13 23.74,58.89 IC9.3 | v54.48,25.36 56.76,23.08 v56.76,18 | v88.26,16.73 SV2.40
DATA_IN  (via drill 0.71)
  Top 0.203: v22.47,50.76 22.22,51.02 14.35,51.02 13.58,50.25 IC4.5 | v85.47,72.35 v72.26,72.35 64.89,72.35 64.38,71.84 62.61,71.84 61.59,72.86 v57.02,72.86 | v56,78.19 55.24,78.96 34.92,78.96 33.9,79.97 29.08,79.97 v28.06,78.96 | v85.21,84.04 IC3.4 | v74.8,40.86 75.31,41.36 v77.85,41.36
  Bottom 0.203: v22.47,50.76 22.47,58.38 22.98,58.89 22.98,74.89 24,75.91 IC25.5 26.03,76.92 v28.06,78.96 | v85.21,84.04 85.47,83.78 v85.47,72.35 | v57.02,72.86 56,73.88 v56,78.19 | v74.8,40.86 71.75,37.81 71.75,24.6 72.26,24.09 72.26,11.65 71.75,11.14 71.75,3.01 59.05,3.01 SV2.13 | v77.85,41.36 78.35,41.87 78.35,48.22 79.12,48.98 79.12,59.14 77.59,60.67 77.59,62.7 76.58,63.72 72.26,63.72 v72.26,72.35
DISK_LED
  Bottom 0.203: SV4.3 138.55,96.99 137.54,96.99 136.77,96.23 130.93,96.23 130.93,97.24 R4.2
DMA0  (via drill 0.71)
  Top 0.203: v30.09,37.05 19.43,37.05 18.66,36.28 IC13.7 | v30.35,70.83 30.86,70.32 36.19,70.32 37.71,71.84 51.68,71.84 | 51.68,71.84 52.45,72.61 IC17.33 | v65.15,71.34 62.35,71.34 61.59,72.1 57.53,72.1 57.27,71.84 51.68,71.84
  Bottom 0.203: v30.09,37.05 30.09,64.73 32.13,66.76 32.13,69.05 v30.35,70.83 | v65.15,71.34 65.15,72.1 69.21,72.1 69.72,71.59 69.72,67.27 68.96,66.51 IC8.8
DMA1  (via drill 0.71)
  Top 0.203: v50.67,38.06 29.84,38.06 29.33,37.55 17.39,37.55 16.12,36.28 IC13.6 | v62.35,70.07 54.99,70.07 IC17.32
  Bottom 0.203: v50.67,38.06 50.67,59.4 52.95,61.68 55.49,61.68 55.49,69.05 54.73,69.81 IC17.32 | v62.35,70.07 65.91,66.51 65.91,62.45 66.92,61.43 IC8.6
DMA2  (via drill 0.71)
  Top 0.203: v48.38,39.08 47.87,38.57 17.65,38.57 16.38,37.3 6.98,37.3 5.96,36.28 IC13.2 | v50.16,67.78 IC17.31 54.99,67.53 v62.61,67.53
  Bottom 0.203: v48.38,39.08 50.16,40.86 v50.16,67.78 | v62.61,67.53 65.4,64.73 65.4,57.87 66.92,56.35 IC8.4
DMA3  (via drill 0.71)
  Top 0.203: v6.73,64.48 6.73,73.62 7.23,73.62 8.25,74.64 8.25,76.16 17.14,76.16 18.41,77.43 v34.41,77.43
  Bottom 0.203: v6.73,64.48 6.73,61.94 8.25,60.41 8.25,59.65 9.01,58.89 9.01,37.3 8.25,36.54 IC13.3 | v34.41,77.43 36.7,79.72 36.7,91.15 42.03,96.48 51.94,96.48 51.94,95.47 | 51.94,95.47 51.94,63.97 52.7,63.21 IC17.29 | 51.94,95.47 59.05,95.47 64.64,89.88 64.64,77.69 70.23,72.1 70.23,52.54 68.96,51.27 IC8.2
DMA4  (via drill 0.71)
  Top 0.203: v56,52.54 56.26,52.29 74.54,52.29 IC12.7
  Bottom 0.203: IC1.17 75.56,29.68 76.32,30.44 76.32,47.71 77.59,48.98 77.59,50.76 76.83,51.52 IC12.7 | v56,52.54 56,58.38 54.73,59.65 IC17.28
DMA5  (via drill 0.71)
  Top 0.203: v70.23,33.24 v81.15,33.24 | v81.66,53.05 80.39,54.32 77.08,54.32 IC12.6 74.54,54.83 72.51,56.86 55.49,56.86 54.99,57.37 IC17.27
  Bottom 0.203: v81.15,33.24 81.4,33.49 81.4,46.7 81.15,46.95 81.15,52.54 v81.66,53.05 | IC1.15 v70.23,33.24
DMA6  (via drill 0.71)
  Top 0.203: v64.13,53.3 62.61,54.83 54.99,54.83 IC17.26 | v64.38,64.48 74.54,64.48 IC12.2
  Bottom 0.203: IC1.13 64.89,29.68 64.13,30.44 64.13,37.3 64.64,37.81 64.64,44.92 64.13,45.43 v64.13,53.3 64.38,53.81 v64.38,64.48
DMA7  (via drill 0.71)
  Top 0.203: v56.76,29.68 59.3,29.68 59.56,29.43 IC1.11 | v73.53,44.16 73.27,44.41 65.91,44.41 65.15,43.65 v55.49,43.65
  Bottom 0.203: v56.76,29.68 55.49,30.95 v55.49,43.65 55.49,51.27 54.73,52.03 IC17.25 | v73.53,44.16 73.53,60.41 74.8,61.68 IC12.3
DMA8  (via drill 0.71)
  Top 0.203: v58.03,48.22 56.51,48.22 54.99,49.75 IC17.24 | v60.57,45.68 v65.15,45.68 87.5,45.68 v88.01,46.19 | v88.26,51.52 89.53,51.52 89.78,51.78 IC11.7
  Bottom 0.203: v60.57,45.68 v58.03,48.22 | IC1.8 v65.15,45.68 | v88.26,51.52 88.01,51.27 v88.01,46.19
DMA9  (via drill 0.71)
  Top 0.203: IC17.23 54.99,47.21 55.49,46.7 v67.43,46.7 67.69,46.19 84.7,46.19 v85.21,46.7 | v85.21,53.56 85.72,54.06 89.53,54.06 89.78,54.32 IC11.6
  Bottom 0.203: v67.43,46.7 69.97,44.16 69.97,37.3 IC1.6 | v85.21,46.7 v85.21,53.56
DMA10  (via drill 0.71)
  Top 0.203: 74.29,44.67 v75.05,43.9 | 74.29,44.67 73.78,45.17 65.91,45.17 65.4,44.67 54.99,44.67 IC17.22 | 74.29,44.67 v85.21,44.67 | v88.26,64.73 IC11.2
  Bottom 0.203: v75.05,43.9 75.81,43.14 75.81,37.05 IC1.4 | v88.26,64.73 87.24,63.72 87.24,47.97 87.5,47.71 87.5,46.95 v85.21,44.67
DMA11  (via drill 0.71)
  Top 0.203: v80.39,40.86 78.86,42.38 IC17.21 | v80.64,61.18 89.02,61.18 89.78,61.94 IC11.3
  Bottom 0.203: IC1.2 v80.39,40.86 80.64,41.36 v80.64,61.18
DQ0  (via drill 0.71)
  Top 0.203: v47.87,45.17 39.75,45.17 IC17.19 | v48.13,70.32 49.14,71.34 59.05,71.34 IC8.11 | v50.92,23.84 96.64,23.84 97.15,23.33 IC6.18
  Bottom 0.203: v48.13,70.32 48.13,66 48.38,65.75 48.38,53.3 48.13,53.05 48.13,45.43 v47.87,45.17 47.37,44.92 47.37,35.52 50.92,31.97 v50.92,23.84
DQ1  (via drill 0.71)
  Top 0.203: v49.14,47.71 v46.86,47.71 39.75,47.71 IC17.18 | v49.14,66.26 59.05,66.26 IC8.13 | v95.63,27.9 97.15,27.9 IC6.16 | v94.1,25.87 93.59,26.38 53.21,26.38 v49.91,29.68
  Bottom 0.203: v49.14,47.71 v49.14,66.26 | v95.63,27.9 94.1,26.38 v94.1,25.87 | v49.91,29.68 48.89,30.7 48.89,33.24 46.86,35.27 v46.86,47.71
DQ2  (via drill 0.71)
  Top 0.203: v41.78,60.16 42.79,61.18 56.76,61.18 57.27,60.67 59.05,60.67 IC8.15 61.59,60.67 62.35,59.91 71.5,59.91 v71.75,59.65 | v91.82,39.84 91.31,39.33 72,39.33 v71.5,39.84 | v93.34,33.24 IC6.14
  Bottom 0.203: v41.78,60.16 41.78,56.6 40.76,55.59 40.76,51.78 39.49,50.51 IC17.17 | v93.34,33.24 91.82,34.76 v91.82,39.84 | v71.5,39.84 71.5,59.4 v71.75,59.65
DQ3  (via drill 0.71)
  Top 0.203: v40.25,56.35 40.51,56.1 59.05,56.1 IC8.17 | v63.11,38.32 IC6.12
  Bottom 0.203: v40.25,56.35 40.25,53.81 39.49,53.05 IC17.16 | v63.11,38.32 62.61,38.82 62.61,54.06 61.34,55.33 IC8.17
DQ4  (via drill 0.71)
  Top 0.203: v26.54,55.84 27.05,55.33 37.21,55.33 IC17.15 v41.78,55.08 | v87.24,37.3 104.01,37.3 104.77,38.06 IC6.9 | v85.72,40.35 85.21,39.84 72.77,39.84 71.75,40.86 62.35,40.86 61.84,40.35 v60.57,40.35 | v57.53,45.68 57.02,46.19 v42.29,46.19
  Bottom 0.203: v26.54,55.84 26.54,60.67 25.78,61.43 IC9.2 | v87.24,37.3 85.72,38.82 v85.72,40.35 | v60.57,40.35 57.53,43.4 v57.53,45.68 | v42.29,46.19 42.79,46.7 42.79,54.06 v41.78,55.08
DQ5  (via drill 0.71)
  Top 0.203: IC9.4 26.03,57.11 26.79,57.87 37.21,57.87 IC17.14 | v79.37,34.25 104.01,34.25 104.77,33.49 IC6.7 | v79.12,61.18 69.97,61.18 68.7,62.45 63.62,62.45 61.59,64.48 55.24,64.48 54.99,64.22 45.59,64.22 45.08,64.73 43.3,64.73 v41.27,62.7
  Bottom 0.203: v79.37,34.25 79.37,47.71 80.13,48.48 80.13,60.16 v79.12,61.18 | v41.27,62.7 40.25,61.68 40.25,58.89 39.49,58.13 IC17.14
DQ6  (via drill 0.71)
  Top 0.203: IC9.6 23.49,52.03 20.44,55.08 15.11,55.08 14.6,55.59 14.6,64.48 19.93,64.48 23.49,60.92 v29.08,60.92 36.7,60.92 37.21,60.41 IC17.13 | v80.13,32.22 83.69,32.22 86.74,29.17 104.01,29.17 104.77,28.41 IC6.5 | v74.29,68.54 73.27,69.56 63.11,69.56 62.61,69.05 62.1,69.05 61.59,69.56 55.24,69.56 54.99,69.3 33.4,69.3 v31.11,67.02
  Bottom 0.203: v80.13,32.22 78.35,34 78.35,34.51 78.86,35.01 78.86,47.97 79.62,48.73 79.62,59.4 78.1,60.92 78.1,64.73 76.58,66.26 74.04,66.26 74.04,68.29 v74.29,68.54 | v31.11,67.02 29.08,64.99 v29.08,60.92
DQ7  (via drill 0.71)
  Top 0.203: v36.7,46.44 35.94,45.68 26.79,45.68 26.03,46.44 IC9.8 | v104.01,13.17 103.5,12.66 v92.07,12.66 | v88.26,5.3 88.01,5.04 67.18,5.04 66.67,4.53 50.92,4.53 v50.16,5.3 | v49.65,34.51 49.14,35.01 v30.86,35.01
  Bottom 0.203: v36.7,46.44 36.7,61.43 37.46,62.19 IC17.12 | v104.01,13.17 104.01,21.55 105.02,22.57 IC6.3 | v92.07,12.66 91.82,12.41 91.82,8.85 v88.26,5.3 | v50.16,5.3 48.89,6.57 48.89,13.42 50.41,14.95 50.41,22.06 51.94,23.58 51.94,24.09 51.43,24.6 51.43,32.73 v49.65,34.51 | v30.86,35.01 27.05,38.82 27.05,44.92 25.78,46.19 IC9.8
DQ8  (via drill 0.71)
  Top 0.203: v34.67,53.81 34.92,53.56 40.51,53.56 41.52,52.54 v46.86,52.54 | v46.86,68.29 46.6,68.03 39.75,68.03 IC17.10 | v112.39,39.59 107.82,39.59 107.56,39.84 103.75,39.84 v101.47,42.13 | v95.88,83.02 56,83.02 54.48,81.5 v49.91,81.5 | v112.14,23.33 IC2.18
  Bottom 0.203: v34.67,53.81 34.67,43.4 33.4,42.13 IC9.11 | v46.86,52.54 47.87,53.56 47.87,65.49 46.86,66.51 v46.86,68.29 47.11,68.8 47.11,78.7 v49.91,81.5 | v112.14,23.33 112.39,23.58 v112.39,39.59 | v101.47,42.13 101.47,50.76 100.45,51.78 100.45,70.07 95.37,75.15 95.37,82.51 v95.88,83.02
DQ9  (via drill 0.71)
  Top 0.203: v29.08,47.21 30.86,47.21 31.11,46.95 IC9.13 | v27.05,67.02 29.84,69.81 37.46,69.81 IC17.9 39.75,70.57 44.06,70.57 v44.32,70.83 | v89.28,31.2 95.63,31.2 96.13,31.71 99.69,31.71 100.2,31.2 100.71,31.2 101.21,31.71 107.31,31.71 107.56,31.46 116.96,31.46 117.47,31.97 125.09,31.97 125.09,29.68 124.33,28.92 121.79,28.92 121.53,28.66 IC2.16 | v89.78,40.35 92.07,42.63 v96.9,42.63 | v96.39,64.73 94.86,66.26 v88.26,66.26 | v88.26,76.92 87.75,77.43 69.46,77.43 69.21,77.69 56.76,77.69 56,76.92 v46.1,76.92
  Bottom 0.203: v29.08,47.21 28.57,47.71 28.57,51.02 27.05,52.54 27.05,55.08 27.55,55.59 27.55,66.51 v27.05,67.02 | v89.28,31.2 88.77,31.71 88.77,39.33 v89.78,40.35 | v96.9,42.63 96.39,43.14 v96.39,64.73 | v88.26,76.92 v88.26,66.26 | v46.1,76.92 44.32,75.15 v44.32,70.83
DQ10  (via drill 0.71)
  Top 0.203: v28.06,52.79 30.35,52.79 31.11,52.03 IC9.15 | v28.06,71.34 29.33,72.61 37.21,72.61 IC17.8 | v117.22,91.15 115.69,92.67 103.5,92.67 102.99,92.16 99.94,92.16 99.44,92.67 69.46,92.67 69.21,92.93 56.51,92.93 55.24,91.66 v49.4,91.66
  Bottom 0.203: v28.06,52.79 v28.06,71.34 | v117.22,91.15 117.22,72.61 116.45,71.84 116.45,47.46 117.72,46.19 117.72,35.52 119.25,34 IC2.14 | v49.4,91.66 40.25,82.51 40.25,74.13 39.49,73.37 IC17.8
DQ11  (via drill 0.71)
  Top 0.203: v35.68,75.4 IC17.7 | v102.48,39.33 107.31,39.33 108.07,38.57 IC2.12 | v102.48,55.59 99.44,58.64 v85.47,58.64 | v80.39,66 80.13,66.26 74.04,66.26 73.27,67.02 63.62,67.02 63.11,66.51 62.1,66.51 61.59,67.02 55.24,67.02 54.99,66.76 49.91,66.76 49.4,67.27 40.25,67.27 39.75,66.76 v35.68,66.76
  Bottom 0.203: v35.68,75.4 v35.68,66.76 35.68,59.65 33.4,57.37 IC9.17 | v102.48,55.59 v102.48,39.33 | v85.47,58.64 85.21,58.89 85.21,65.24 84.45,66 v80.39,66
DRL  (via drill 0.71)
  Top 0.203: v140.08,63.21 146.17,63.21 146.93,63.97 IC5.2
  Bottom 0.203: v140.08,63.21 140.08,61.94 135.25,57.11 IC7.5
EA1  (via drill 0.71)
  Top 0.203: v94.36,85.05 84.7,85.05 83.94,84.29 IC10.11 | v95.37,32.22 v100.45,32.22 | v47.87,30.7 48.38,31.2 v60.57,31.2 | v60.57,38.32 61.59,39.33 70.73,39.33 71.24,38.82 94.86,38.82 v95.37,39.33 | v139.57,43.9 138.04,45.43 130.42,45.43 129.41,46.44 99.44,46.44 98.67,45.68 v94.86,45.68
  Bottom 0.203: v94.36,85.05 94.36,45.68 94.61,45.43 | 94.61,45.43 95.37,44.67 v95.37,39.33 v95.37,32.22 | v100.45,32.22 100.71,31.97 100.71,15.96 99.94,15.2 99.94,11.39 102.23,9.11 102.23,6.06 103.25,5.04 SV1.5 | v47.87,30.7 47.87,25.87 47.11,25.11 IC19.2 | v60.57,31.2 61.08,31.71 61.08,37.81 v60.57,38.32 | v139.57,43.9 139.57,32.98 140.58,31.97 IC16.3 | 94.61,45.43 v94.86,45.68
EA2  (via drill 0.71)
  Top 0.203: v41.27,20.54 40,19.27 v37.71,19.27 | v40.51,2.25 41.27,1.49 93.09,1.49 95.12,3.52 97.66,3.52 98.17,3.01 104.77,3.01 SV1.7 | v140.33,13.93 138.81,12.41 128.14,12.41 127.88,12.15 108.58,12.15 v108.07,12.66
  Bottom 0.203: v41.27,20.54 41.27,22.31 41.52,22.57 IC19.4 | v37.71,19.27 37.71,9.11 37.21,8.6 37.21,5.55 v40.51,2.25 | v140.33,13.93 143.63,17.23 143.63,31.71 142.11,33.24 IC16.2 | v108.07,12.66 107.31,11.9 107.31,6.06 106.29,5.04 SV1.7
EA3  (via drill 0.71)
  Top 0.203: v38.73,13.42 39.75,12.41 49.65,12.41 50.92,11.14 67.18,11.14 67.43,10.88 v73.02,10.88 | v74.29,4.03 74.54,4.28 94.36,4.28 95.63,5.55 106.8,5.55 107.56,4.79 108.07,4.79 SV1.9 | v110.1,23.08 111.37,24.35 121.53,24.35 122.04,23.84 123.82,23.84 124.33,24.35 139.57,24.35 140.08,23.84 IC16.6
  Bottom 0.203: v38.73,13.42 38.22,13.93 38.22,17.49 38.73,18 38.73,20.79 36.95,22.57 IC19.6 | v73.02,10.88 74.29,9.61 v74.29,4.03 | v110.1,23.08 110.1,7.33 109.85,7.07 109.85,6.06 108.83,5.04 SV1.9
EMA1  (via drill 0.71)
  Top 0.203: v8,25.62 30.35,25.62 31.11,24.85 IC19.8 | v46.1,75.4 46.6,74.89 52.19,74.89 52.45,75.15 IC17.34 | v35.68,30.7 v44.32,30.7
  Bottom 0.203: IC14.3 v8,25.62 | v46.1,75.4 45.33,74.64 45.33,65.49 43.81,63.97 43.81,55.33 44.32,54.83 v44.32,30.7 | v35.68,30.7 31.87,26.89 31.87,25.11 IC19.8
EMA2  (via drill 0.71)
  Top 0.203: v6.47,15.46 6.98,14.95 v14.09,14.95 26.28,14.95 IC19.11 | v9.77,66 21.71,66 21.71,68.29 20.95,69.05 20.95,72.1 23.74,74.89 25.78,74.89 26.79,75.91 29.59,75.91 30.09,75.4 33.9,75.4 34.92,76.42 39.24,76.42 40.76,77.94 IC17.35 | v15.11,52.03 v12.06,55.08
  Bottom 0.203: v6.47,15.46 6.47,20.54 5.71,21.3 IC14.2 | v9.77,66 9.77,61.43 12.06,59.14 v12.06,55.08 | v15.11,52.03 14.6,51.52 14.6,45.94 15.11,45.43 15.11,44.67 14.09,43.65 v14.09,14.95
EMA3  (via drill 0.71)
  Top 0.203: v17.65,20.03 18.16,19.52 28.82,19.52 31.11,17.23 IC19.13 | IC4.1 3.42,50.25 4.19,51.02 5.96,51.02 6.98,50 6.98,40.6 v15.11,40.6 15.62,40.35 16.38,39.59 39.49,39.59 v42.29,42.38 | v44.32,80.48 IC17.36
  Bottom 0.203: 16.63,21.04 v17.65,20.03 | 16.63,21.04 16.12,21.55 IC14.6 | v15.11,40.6 16.63,39.08 16.63,21.04 | v44.32,80.48 42.79,78.96 42.79,54.83 43.3,54.32 43.3,43.4 v42.29,42.38
EMA4  (via drill 0.71)
  Top 0.203: v36.7,20.28 36.44,20.54 19.68,20.54 18.66,21.55 IC14.7 17.65,21.55 16.89,20.79 1.39,20.79 1.39,44.16 4.69,47.46 | 4.69,47.46 5.2,47.97 IC4.2 | v28.32,83.02 33.4,83.02 34.41,82 39.75,82 40.25,82.51 52.19,82.51 52.45,82.77 IC17.37 | v27.3,81.5 26.28,82.51 23.74,82.51 22.98,81.75 22.98,79.21 3.93,79.21 1.65,76.92 1.65,47.46 4.69,47.46
  Bottom 0.203: v36.7,20.28 IC19.15 | v28.32,83.02 27.3,82 v27.3,81.5
EMA5  (via drill 0.71)
  Top 0.203: v11.55,47.46 9.27,47.46 8.5,48.22 IC4.3 8.25,50.51 9.01,50.51 9.01,57.62 10.03,58.64 11.81,58.64 11.81,63.46 13.84,65.49 33.65,65.49 34.92,64.22 v40.76,64.22 | v41.52,11.39 41.27,11.14 v38.73,11.14 | v38.22,8.34 9.01,8.34 8.25,9.11 IC15.3 | v46.35,85.31 52.45,85.31 IC17.38
  Bottom 0.203: v11.55,47.46 11.55,28.66 12.06,28.16 12.06,21.04 11.81,20.79 11.81,6.31 10.54,6.31 8,8.85 IC15.3 | v41.52,11.39 41.52,14.95 IC19.17 | v38.73,11.14 38.22,10.63 v38.22,8.34 | v46.35,85.31 40.76,79.72 v40.76,64.22
ERRSKIP  (via drill 0.71)
  Top 0.203: v153.03,53.81 154.81,52.03 IC5.8
  Bottom 0.203: v153.03,53.81 153.54,54.32 153.54,71.84 154.55,72.86 IC21.8
EWL  (via drill 0.71)